# Altium schematic sheet Sheet2.SchDoc
size 420 x 297 mm; Author: ALTIUM GOSTBOM2.0 KEV; SheetNumber: 2; SheetTotal: 2
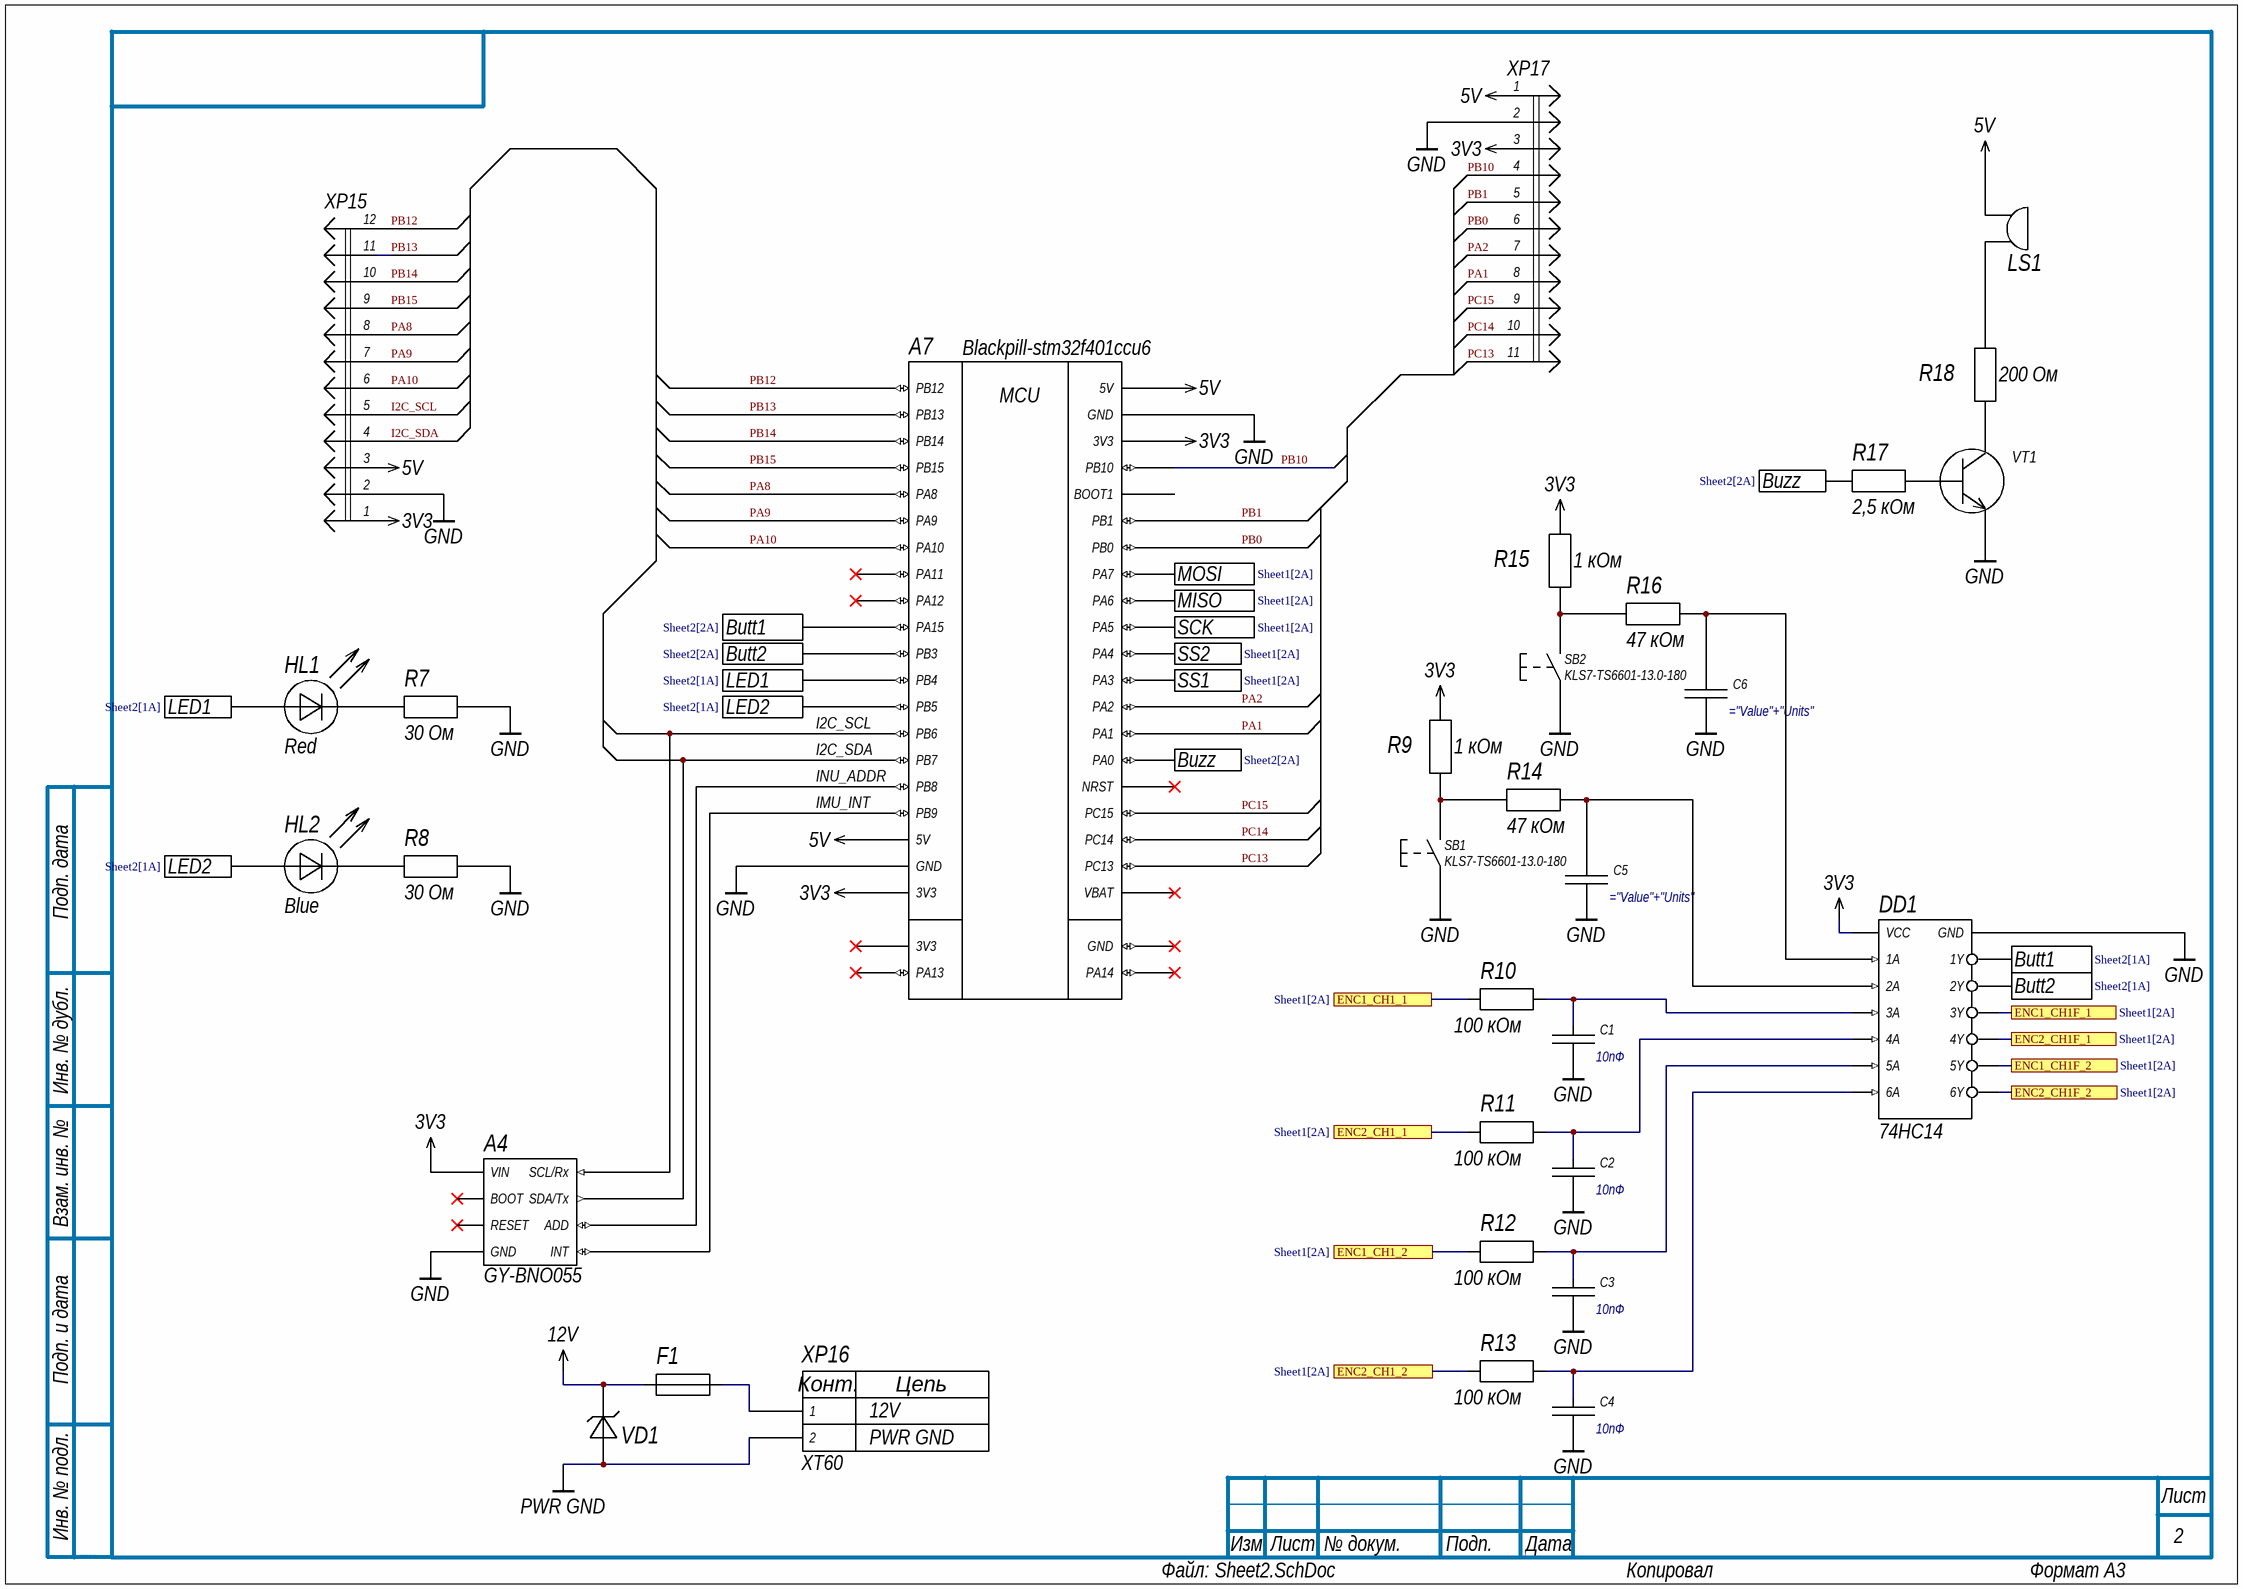
[diagram p0: Sheet2.SchDoc]

## Parts
A4  GY-BNO055  [GY-BNO055 board]
A7  Blackpill-stm32f401ccu6  [BluePill]
C1  10пФ  [C0603C]
C2  10пФ  [C0603C]
C3  10пФ  [C0603C]
C4  10пФ  [C0603C]
C5  (no value)  [C0603C]
C6  (no value)  [C0603C]
DD1  74HC14  [SO-14]
F1  ва  [BLX-A]  (value not drawn)
HL1  Обозначение при заказе  [ledrad3mm]  (value not drawn)
HL2  Обозначение при заказе  [ledrad3mm]  (value not drawn)
LS1  Обозначение при заказе  [Buzzer 12mm]  (value not drawn)
R7  ва  [R0603]  (value not drawn)
R8  ва  [R0603]  (value not drawn)
R9  ва  [R0603]  (value not drawn)
R10  ва  [R0603]  (value not drawn)
R11  ва  [R0603]  (value not drawn)
R12  ва  [R0603]  (value not drawn)
R13  ва  [R0603]  (value not drawn)
R14  ва  [R0603]  (value not drawn)
R15  ва  [R0603]  (value not drawn)
R16  ва  [R0603]  (value not drawn)
R17  ва  [R0603]  (value not drawn)
R18  ва  [R1210]  (value not drawn)
SB1  KLS7-TS6601-13.0-180  [Button]
SB2  KLS7-TS6601-13.0-180  [Button]
VD1  Диод защитный  [SMB]  (value not drawn)
VT1  (no value)  [SOT23-3-BEC]
XP15  (no value)  [PLS-12]
XP16  XT60  [XT60UPB-M]
XP17  (no value)  [PLS-11]

## Ports
Butt1 (see Sheet2[1A]), Butt1 (see Sheet2[2A]), Butt2 (see Sheet2[1A]), Butt2 (see Sheet2[2A]), Buzz (see Sheet2[2A]), ENC1_CH1_1 (see Sheet1[2A]), ENC1_CH1_2 (see Sheet1[2A]), ENC1_CH1F_1 (see Sheet1[2A]), ENC1_CH1F_2 (see Sheet1[2A]), ENC2_CH1_1 (see Sheet1[2A]), ENC2_CH1_2 (see Sheet1[2A]), ENC2_CH1F_1 (see Sheet1[2A]), ENC2_CH1F_2 (see Sheet1[2A]), LED1 (see Sheet2[1A]), LED2 (see Sheet2[1A]), MISO (see Sheet1[2A]), MOSI (see Sheet1[2A]), SCK (see Sheet1[2A]), SS1 (see Sheet1[2A]), SS2 (see Sheet1[2A])

## Nets
3V3: A4.8(VIN) A7.20(3V3) A7.23(3V3) DD1.14(VCC) R9.1 R15.1 XP15.1 XP17.3
5V: A7.18(5V) A7.21(5V) LS1.1 XP15.3 XP17.1
12V: F1.1 VD1.2
GND: A4.7(GND) A7.19(GND) A7.22(GND) C1.2 C2.2 C3.2 C4.2 C5.2 C6.2 DD1.7(GND) R7.2 R8.2 SB1.1(S1) SB2.1(S1) VT1.E XP15.2 XP17.2
PWR GND: VD1.1 XP16.2
Butt1: A7.10(PA15) DD1.2(1Y) ; port Butt1
Butt2: A7.11(PB3) DD1.4(2Y) ; port Butt2
Buzz: A7.35(PA0) R17.1 ; port Buzz
ENC1_CH1_1: R10.1 ; port ENC1_CH1_1
ENC1_CH1_2: R12.1 ; port ENC1_CH1_2
ENC1_CH1F_1: DD1.6(3Y) ; port ENC1_CH1F_1
ENC1_CH1F_2: DD1.10(5Y) ; port ENC1_CH1F_2
ENC2_CH1_1: R11.1 ; port ENC2_CH1_1
ENC2_CH1_2: R13.1 ; port ENC2_CH1_2
ENC2_CH1F_1: DD1.8(4Y) ; port ENC2_CH1F_1
ENC2_CH1F_2: DD1.12(6Y) ; port ENC2_CH1F_2
I2C_SCL: A4.6(SCL/Rx) A7.14(PB6) XP15.5
I2C_SDA: A4.5(SDA/Tx) A7.15(PB7) XP15.4
IMU_INT: A4.3(INT) A7.17(PB9)
INU_ADDR: A4.4(ADD) A7.16(PB8)
LED1: A7.12(PB4) HL1.1(A) ; port LED1
LED2: A7.13(PB5) HL2.1(A) ; port LED2
MISO: A7.29(PA6) ; port MISO
MOSI: A7.28(PA7) ; port MOSI
PA1: A7.34(PA1) XP17.8
PA2: A7.33(PA2) XP17.7
PA8: A7.5(PA8) XP15.8
PA9: A7.6(PA9) XP15.7
PA10: A7.7(PA10) XP15.6
PB0: A7.27(PB0) XP17.6
PB1: A7.26(PB1) XP17.5
PB10: A7.24(PB10) XP17.4
PB12: A7.1(PB12) XP15.12
PB13: A7.2(PB13) XP15.11
PB14: A7.3(PB14) XP15.10
PB15: A7.4(PB15) XP15.9
PC13: A7.39(PC13) XP17.11
PC14: A7.38(PC14) XP17.10
PC15: A7.37(PC15) XP17.9
SCK: A7.30(PA5) ; port SCK
SS1: A7.32(PA3) ; port SS1
SS2: A7.31(PA4) ; port SS2
NetC1_1: C1.1 DD1.5(3A) R10.2
NetC2_1: C2.1 DD1.9(4A) R11.2
NetC3_1: C3.1 DD1.11(5A) R12.2
NetC4_1: C4.1 DD1.13(6A) R13.2
NetC5_1: C5.1 DD1.3(2A) R14.2
NetC6_1: C6.1 DD1.1(1A) R16.2
NetF1_2: F1.2 XP16.1
NetHL1_2: HL1.2(C) R7.1
NetHL2_2: HL2.2(C) R8.1
NetLS1_2: LS1.2 R18.2
NetR9_2: R9.2 R14.1 SB1.2(S2)
NetR15_2: R15.2 R16.1 SB2.2(S2)
NetR17_2: R17.2 VT1.B
NetR18_1: R18.1 VT1.C

Not connected (* = marked no-connect by the designer): A4 1(RESET)* 2(BOOT)*; A7 8(PA11)* 9(PA12)* 25(BOOT1) 36(NRST)* 40(VBAT)* 41(3V3)* 42(PA13)* 43(PA14)* 44(GND)*

## Notes on the sheet
- (near R18) 200 Ом
- (near VT1) 2,5 кОм
- (near R15) 1 кОм
- (near R16) 47 кОм
- (near HL1) Red
- (near R7) 30 Ом
- (near R9) 1 кОм
- (near R14) 47 кОм
- (near HL2) Blue
- (near R8) 30 Ом
- (near R10) 100 кОм
- (near R11) 100 кОм
- (near R12) 100 кОм
- (near R13) 100 кОм
- Подп. дата
- Инв. № дубл.
- Взам. инв. №
- Подп. и дата
- Инв. № подл.
- Изм.
- Лист
- № докум.
- Подп.
- Дата
- ALTIUM GOSTBOM2.0 KEV
- Файл:
- Копировал
- Формат А3
- (in symbol BlackPill) MCU
- (in symbol XT60) Конт.; Цепь; 12V; PWR GND

## Library data of the parts
A4 = GY-BNO055: Девятиосный датчик инерциальной навигации
A7 = BlackPill: Отладочная плата на основе микроконтроллера stm32f401ccu6
C1-C4 = Capasitor: Конденсатор 0603; Value: 10; Units: пФ
C5 C6 = Capasitor: Конденсатор 0603
DD1 = 74HC14: Инвертирующий гестерезисный триггер Шмитта (SO14)
F1 = Fuse: Предохранитель плавкий
HL1 HL2 = LED: LED 3мм
LS1 = Buzzer: Зуммер 5В (D=12мм)
R7-R17 = R1_POSTOYANNYJ_W0.5: Резистор постоянный
R18 = Resisitor: Резистор постоянный
SB1 SB2 = Button: Тактовая кнопка 6x6 мм; Part number: KLS7-TS6601-13.0-180
VD1 = Diode TVS
VT1 = BCR112E6327HTSA1: NPN Биполярный транзистор (SOT23)
XP15 = Connector-12: PLS12
XP17 = Connector-11: PLS11